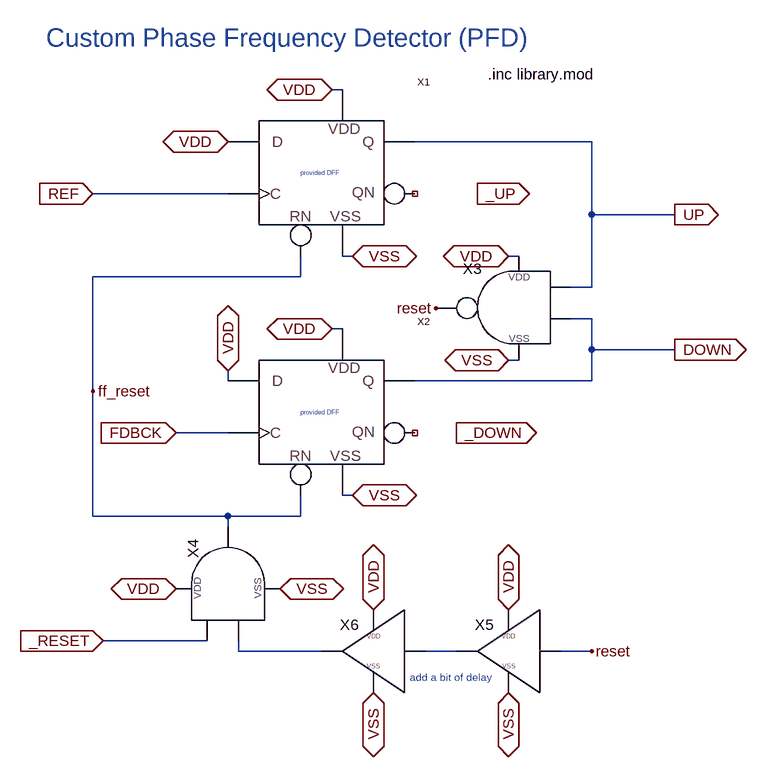
[diagram p0: schematic my_pfd.asc]
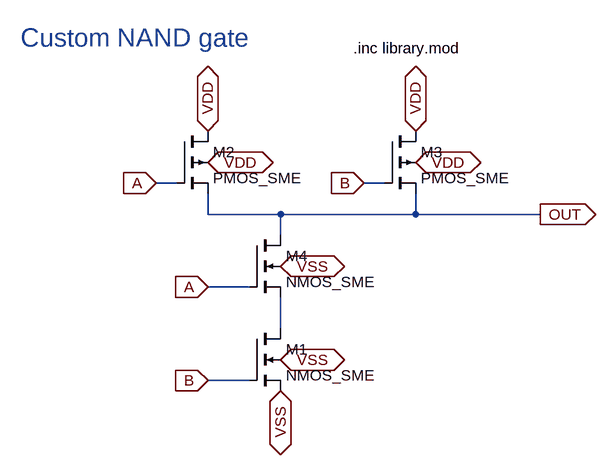
[diagram p1: sub-circuit my_nand.asc]
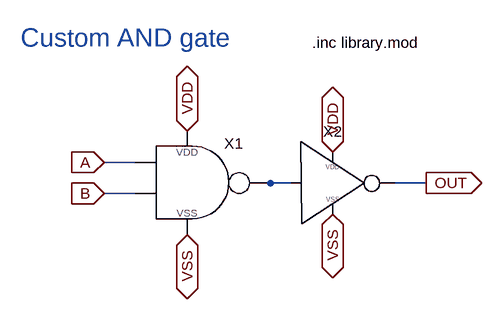
[diagram p2: sub-circuit my_and.asc]
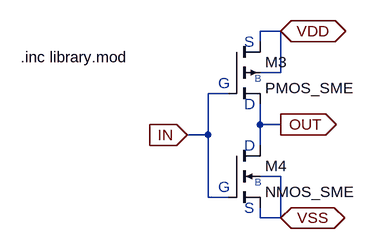
[diagram p3: sub-circuit my_inverter.asc]
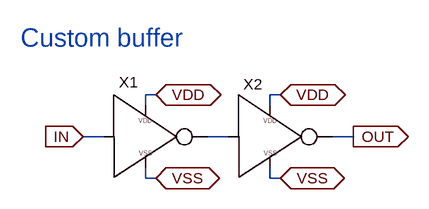
[diagram p4: sub-circuit my_buffer.asc]
my_pfd.asc, the LTspice schematic file:
Version 4.1
SHEET 1 1072 1336
WIRE 320 112 304 112
WIRE 704 192 432 192
WIRE 144 272 -64 272
WIRE 704 304 704 192
WIRE 832 304 704 304
WIRE 336 368 320 368
WIRE 592 368 576 368
WIRE 256 400 256 368
WIRE 256 400 -64 400
WIRE 704 416 704 304
WIRE 704 416 672 416
WIRE 704 464 672 464
WIRE 320 480 304 480
WIRE 704 512 704 464
WIRE 832 512 704 512
WIRE 592 528 576 528
WIRE 144 560 144 544
WIRE 704 560 704 512
WIRE 704 560 432 560
WIRE -64 576 -64 400
WIRE 144 640 64 640
WIRE 336 736 320 736
WIRE -64 768 -64 576
WIRE 144 768 -64 768
WIRE 256 768 256 736
WIRE 256 768 144 768
WIRE 144 784 144 768
WIRE 112 960 -48 960
WIRE 160 976 160 960
WIRE 288 976 160 976
WIRE 496 976 448 976
WIRE 704 976 656 976
FLAG 144 192 VDD
IOPIN 144 192 BiDir
FLAG 144 544 VDD
IOPIN 144 544 BiDir
FLAG 304 112 VDD
IOPIN 304 112 BiDir
FLAG 304 480 VDD
IOPIN 304 480 BiDir
FLAG 336 368 VSS
IOPIN 336 368 BiDir
FLAG 336 736 VSS
IOPIN 336 736 BiDir
FLAG -64 272 REF
IOPIN -64 272 In
FLAG 64 640 FDBCK
IOPIN 64 640 In
FLAG 832 304 UP
IOPIN 832 304 Out
FLAG 576 368 VDD
IOPIN 576 368 BiDir
FLAG 576 528 VSS
IOPIN 576 528 BiDir
FLAG -48 960 _RESET
IOPIN -48 960 In
FLAG 704 976 reset
FLAG 528 272 _UP
IOPIN 528 272 Out
FLAG 832 512 DOWN
IOPIN 832 512 Out
FLAG 496 640 _DOWN
IOPIN 496 640 Out
FLAG 464 448 reset
FLAG 224 880 VSS
IOPIN 224 880 BiDir
FLAG 64 880 VDD
IOPIN 64 880 BiDir
FLAG 368 1040 VSS
IOPIN 368 1040 BiDir
FLAG 576 1040 VSS
IOPIN 576 1040 BiDir
FLAG 368 912 VDD
IOPIN 368 912 BiDir
FLAG 576 912 VDD
IOPIN 576 912 BiDir
FLAG -64 576 ff_reset
SYMBOL DFRRLHDX1 224 208 R0
SYMATTR InstName X1
SYMBOL DFRRLHDX1 224 576 R0
SYMATTR InstName X2
SYMBOL my_nand 592 448 M0
SYMATTR InstName X3
SYMBOL my_and 144 880 R270
SYMATTR InstName X4
SYMBOL my_buffer 592 976 M0
SYMATTR InstName X5
SYMBOL my_buffer 384 976 M0
SYMATTR InstName X6
TEXT -136 32 Left 4 ;Custom Phase Frequency Detector (PFD)
TEXT 544 88 Left 2 !.inc library.mod
TEXT 256 240 Left 0 ;provided DFF
TEXT 256 608 Left 0 ;provided DFF
TEXT 424 1016 Left 1 ;add a bit of delay

my_nand.asc, the sub-circuit schematic file:
Version 4.1
SHEET 1 880 716
WIRE 128 272 96 272
WIRE 448 272 416 272
WIRE 176 320 176 288
WIRE 288 320 176 320
WIRE 496 320 496 288
WIRE 496 320 288 320
WIRE 688 320 496 320
WIRE 288 352 288 320
WIRE 240 432 176 432
WIRE 288 496 288 448
WIRE 240 576 176 576
FLAG 96 272 A
IOPIN 96 272 In
FLAG 176 432 A
IOPIN 176 432 In
FLAG 416 272 B
IOPIN 416 272 In
FLAG 176 576 B
IOPIN 176 576 In
FLAG 176 192 VDD
IOPIN 176 192 BiDir
FLAG 176 240 VDD
IOPIN 176 240 BiDir
FLAG 496 192 VDD
IOPIN 496 192 BiDir
FLAG 496 240 VDD
IOPIN 496 240 BiDir
FLAG 288 592 VSS
IOPIN 288 592 BiDir
FLAG 288 544 VSS
IOPIN 288 544 BiDir
FLAG 288 400 VSS
IOPIN 288 400 BiDir
FLAG 688 320 OUT
IOPIN 688 320 Out
SYMBOL nmos4 240 496 R0
SYMATTR InstName M1
SYMATTR Value NMOS_SME
SYMATTR Value2 l=0.35u w=0.4u
SYMBOL pmos4 128 192 R0
SYMATTR InstName M2
SYMATTR Value PMOS_SME
SYMATTR Value2 l=0.35u w=0.4u
SYMBOL pmos4 448 192 R0
SYMATTR InstName M3
SYMATTR Value PMOS_SME
SYMATTR Value2 l=0.35u w=0.4u
SYMBOL nmos4 240 352 R0
SYMATTR InstName M4
SYMATTR Value NMOS_SME
SYMATTR Value2 l=0.35u w=0.4u
TEXT -112 48 Left 4 ;Custom NAND gate
TEXT 400 64 Left 2 !.inc library.mod

my_and.asc, the sub-circuit schematic file:
Version 4.1
SHEET 1 1328 780
WIRE 96 272 48 272
WIRE 336 304 272 304
WIRE 544 304 496 304
WIRE 96 320 48 320
FLAG 176 224 VDD
IOPIN 176 224 BiDir
FLAG 176 384 VSS
IOPIN 176 384 BiDir
FLAG 48 272 A
IOPIN 48 272 In
FLAG 48 320 B
IOPIN 48 320 In
FLAG 400 352 VSS
IOPIN 400 352 BiDir
FLAG 400 256 VDD
IOPIN 400 256 BiDir
FLAG 544 304 OUT
IOPIN 544 304 Out
SYMBOL my_nand 176 304 R0
SYMATTR InstName X1
SYMBOL my_inverter 400 304 R0
SYMATTR InstName X2
TEXT -80 80 Left 4 ;Custom AND gate
TEXT 368 88 Left 2 !.inc library.mod

my_inverter.asc, the sub-circuit schematic file:
Version 4.1
SHEET 1 880 680
WIRE 608 -32 576 -32
WIRE 576 -16 576 -32
WIRE 608 32 608 -32
WIRE 608 32 576 32
WIRE 528 64 496 64
WIRE 576 112 576 80
WIRE 608 112 576 112
WIRE 496 128 496 64
WIRE 496 128 464 128
WIRE 576 144 576 112
WIRE 608 192 576 192
WIRE 496 224 496 128
WIRE 528 224 496 224
WIRE 576 256 576 240
WIRE 608 256 608 192
WIRE 608 256 576 256
FLAG 608 -32 VDD
IOPIN 608 -32 BiDir
FLAG 608 256 VSS
IOPIN 608 256 BiDir
FLAG 608 112 OUT
IOPIN 608 112 Out
FLAG 464 128 IN
IOPIN 464 128 In
SYMBOL pmos4 528 -16 R0
SYMATTR InstName M3
SYMATTR Value PMOS_SME
SYMATTR Value2 l=0.35u w=0.4u
SYMBOL nmos4 528 144 R0
SYMATTR InstName M4
SYMATTR Value NMOS_SME
SYMATTR Value2 l=0.35u w=0.4u
TEXT 552 -16 Left 2 ;S
TEXT 552 240 Left 2 ;S
TEXT 552 80 Left 2 ;D
TEXT 552 144 Left 2 ;D
TEXT 512 48 Left 2 ;G
TEXT 512 208 Left 2 ;G
TEXT 568 40 Left 1 ;B
TEXT 568 200 Left 1 ;B
TEXT 208 8 Left 2 !.inc library.mod

my_buffer.asc, the sub-circuit schematic file:
Version 4.1
SHEET 1 880 680
WIRE 112 144 96 144
WIRE 304 144 288 144
WIRE 96 160 96 144
WIRE 288 160 288 144
WIRE 32 208 0 208
WIRE 224 208 192 208
WIRE 416 208 384 208
WIRE 96 272 96 256
WIRE 112 272 96 272
WIRE 288 272 288 256
WIRE 304 272 288 272
FLAG 0 208 IN
IOPIN 0 208 In
FLAG 416 208 OUT
IOPIN 416 208 Out
FLAG 112 144 VDD
IOPIN 112 144 BiDir
FLAG 304 144 VDD
IOPIN 304 144 BiDir
FLAG 304 272 VSS
IOPIN 304 272 BiDir
FLAG 112 272 VSS
IOPIN 112 272 BiDir
SYMBOL my_inverter 96 208 R0
WINDOW 0 -26 -68 Bottom 2
SYMATTR InstName X1
SYMBOL my_inverter 288 208 R0
WINDOW 0 -26 -65 Bottom 2
SYMATTR InstName X2
TEXT -96 56 Left 4 ;Custom buffer

The netlist it stands for:
* my_pfd.asc
X§X1 VDD REF ff_reset NC_01 UP VDD VSS DFRRLHDX1  ; pins D C RN QN Q VDD VSS
X§X2 VDD FDBCK ff_reset NC_02 DOWN VDD VSS DFRRLHDX1  ; pins D C RN QN Q VDD VSS
X§X3 UP DOWN reset VDD VSS my_nand
X§X4 _RESET N001 ff_reset VDD VSS my_and
X§X5 reset N002 VDD VSS my_buffer
X§X6 N002 N001 VDD VSS my_buffer

* block symbol definitions
.subckt my_nand A B OUT VDD VSS
M1 N001 B VSS VSS NMOS_SME l=0.35u w=0.4u
M2 VDD A OUT VDD PMOS_SME l=0.35u w=0.4u
M3 VDD B OUT VDD PMOS_SME l=0.35u w=0.4u
M4 OUT A N001 VSS NMOS_SME l=0.35u w=0.4u
* Custom NAND gate
.inc library.mod
.ends my_nand

.subckt my_and A B OUT VDD VSS
X§X1 A B N001 VDD VSS my_nand
X§X2 N001 OUT VDD VSS my_inverter
* Custom AND gate
.inc library.mod
.ends my_and

.subckt my_inverter IN OUT VDD VSS
M3 VDD IN OUT VDD PMOS_SME l=0.35u w=0.4u
M4 OUT IN VSS VSS NMOS_SME l=0.35u w=0.4u
* S
* S
* D
* D
* G
* G
* B
* B
.inc library.mod
.ends my_inverter

.subckt my_buffer IN OUT VDD VSS
X§X1 IN N001 VDD VSS my_inverter
X§X2 N001 OUT VDD VSS my_inverter
* Custom buffer
.ends my_buffer

.model NMOS NMOS
.model PMOS PMOS
.lib standard.mos
* Custom Phase Frequency Detector (PFD)
.inc library.mod
* provided DFF
* provided DFF
* add a bit of delay
.backanno
.end